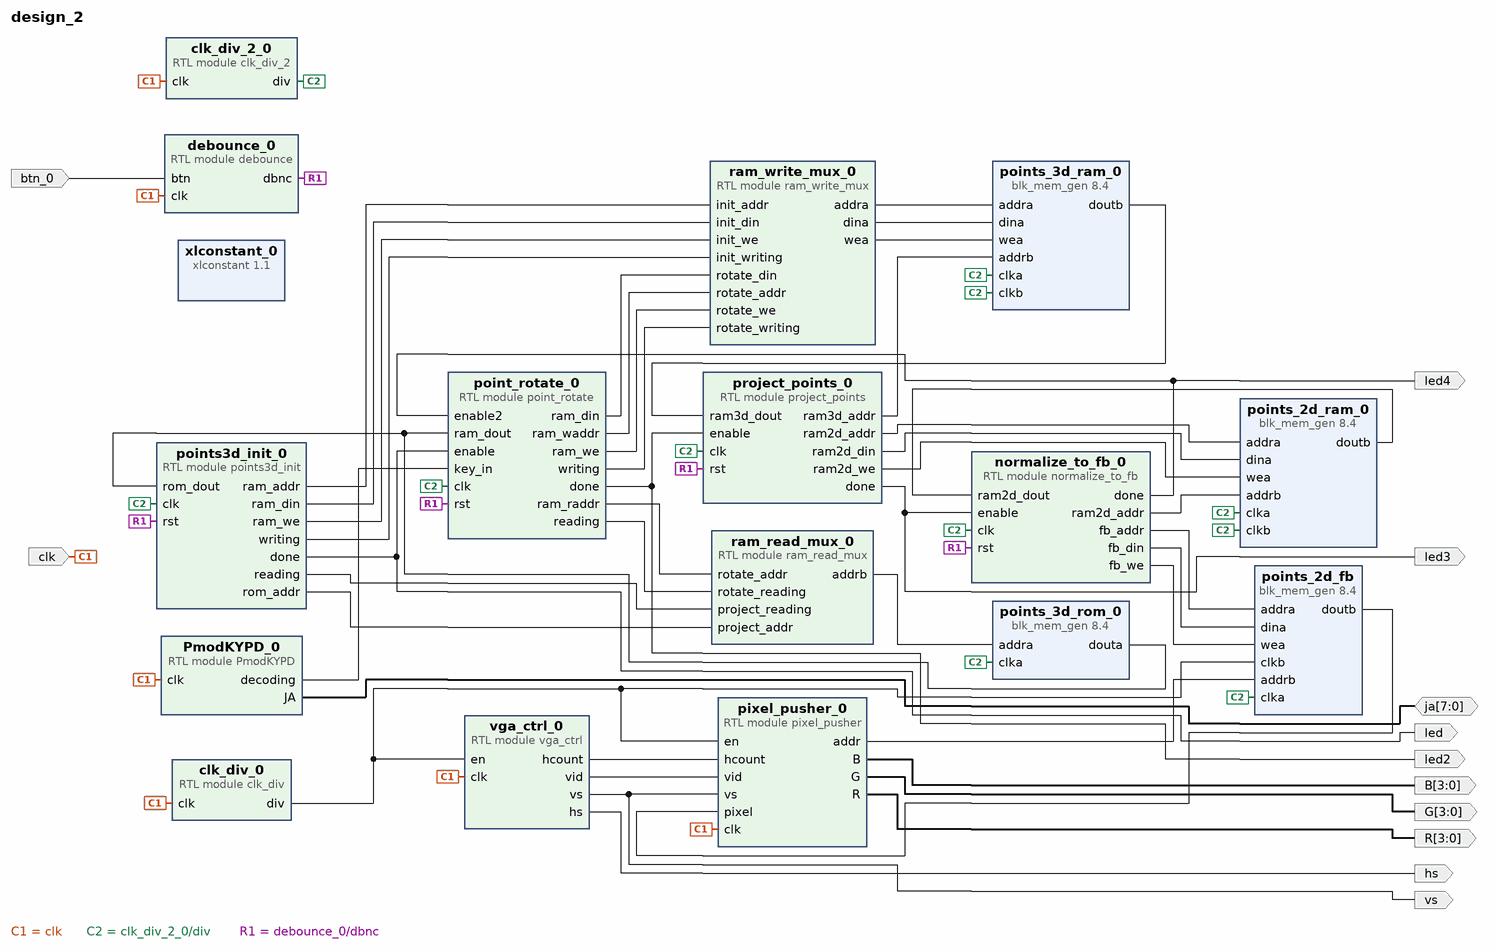
[diagram p0: block diagram of the top level]
# Vivado block design design_2, xc7z010clg400-1, Vivado 2021.1
create_bd_design design_2

create_bd_port -dir I -type clk clk
create_bd_port -dir O led
create_bd_port -dir I btn_0
create_bd_port -dir IO -from 7 -to 0 ja
create_bd_port -dir O led2
create_bd_port -dir O led3
create_bd_port -dir O -from 3 -to 0 R
create_bd_port -dir O -from 3 -to 0 B
create_bd_port -dir O -from 3 -to 0 G
create_bd_port -dir O vs
create_bd_port -dir O hs
create_bd_port -dir O led4

create_bd_cell -type ip -vlnv xilinx.com:ip:blk_mem_gen:8.4 points_3d_rom_0
set_property -dict [list \
  CONFIG.Coe_File {c:/Users/nihal/OneDrive/Desktop/Embed1 FP/reduced_output.coe} \
  CONFIG.Enable_32bit_Address false \
  CONFIG.Enable_A Always_Enabled \
  CONFIG.Load_Init_File true \
  CONFIG.Memory_Type Single_Port_ROM \
  CONFIG.Port_A_Write_Rate 0 \
  CONFIG.Port_B_Clock 0 \
  CONFIG.Port_B_Enable_Rate 0 \
  CONFIG.Port_B_Write_Rate 0 \
  CONFIG.Register_PortA_Output_of_Memory_Primitives false \
  CONFIG.Use_RSTA_Pin false \
  CONFIG.Write_Depth_A 11624 \
  CONFIG.Write_Width_A 48 \
  CONFIG.use_bram_block Stand_Alone \
] [get_bd_cells points_3d_rom_0]
create_bd_cell -type ip -vlnv xilinx.com:ip:blk_mem_gen:8.4 points_3d_ram_0
set_property -dict [list \
  CONFIG.Enable_32bit_Address false \
  CONFIG.Enable_A Always_Enabled \
  CONFIG.Enable_B Always_Enabled \
  CONFIG.Memory_Type True_Dual_Port_RAM \
  CONFIG.Operating_Mode_B WRITE_FIRST \
  CONFIG.Port_B_Clock 100 \
  CONFIG.Port_B_Enable_Rate 100 \
  CONFIG.Port_B_Write_Rate 50 \
  CONFIG.Read_Width_A 48 \
  CONFIG.Read_Width_B 48 \
  CONFIG.Register_PortA_Output_of_Memory_Primitives false \
  CONFIG.Register_PortB_Output_of_Memory_Primitives false \
  CONFIG.Use_Byte_Write_Enable false \
  CONFIG.Use_RSTA_Pin false \
  CONFIG.Write_Depth_A 11624 \
  CONFIG.Write_Width_A 48 \
  CONFIG.Write_Width_B 48 \
  CONFIG.use_bram_block Stand_Alone \
] [get_bd_cells points_3d_ram_0]
create_bd_cell -type module -reference debounce debounce_0
create_bd_cell -type module -reference PmodKYPD PmodKYPD_0
create_bd_cell -type ip -vlnv xilinx.com:ip:xlconstant:1.1 xlconstant_0
set_property -dict {CONFIG.CONST_VAL 10 CONFIG.CONST_WIDTH 4} [get_bd_cells xlconstant_0]
create_bd_cell -type ip -vlnv xilinx.com:ip:blk_mem_gen:8.4 points_2d_ram_0
set_property -dict [list \
  CONFIG.Enable_32bit_Address false \
  CONFIG.Enable_A Always_Enabled \
  CONFIG.Enable_B Always_Enabled \
  CONFIG.Memory_Type True_Dual_Port_RAM \
  CONFIG.Port_A_Write_Rate 50 \
  CONFIG.Port_B_Clock 100 \
  CONFIG.Port_B_Enable_Rate 100 \
  CONFIG.Port_B_Write_Rate 50 \
  CONFIG.Register_PortA_Output_of_Memory_Primitives false \
  CONFIG.Register_PortB_Output_of_Memory_Primitives false \
  CONFIG.Use_Byte_Write_Enable false \
  CONFIG.Use_RSTA_Pin false \
  CONFIG.Use_RSTB_Pin false \
  CONFIG.Write_Depth_A 11624 \
  CONFIG.use_bram_block Stand_Alone \
] [get_bd_cells points_2d_ram_0]
create_bd_cell -type ip -vlnv xilinx.com:ip:blk_mem_gen:8.4 points_2d_fb
set_property -dict [list \
  CONFIG.Enable_32bit_Address false \
  CONFIG.Enable_A Always_Enabled \
  CONFIG.Enable_B Always_Enabled \
  CONFIG.Memory_Type True_Dual_Port_RAM \
  CONFIG.Port_B_Clock 100 \
  CONFIG.Port_B_Enable_Rate 100 \
  CONFIG.Port_B_Write_Rate 50 \
  CONFIG.Read_Width_A 8 \
  CONFIG.Read_Width_B 8 \
  CONFIG.Register_PortA_Output_of_Memory_Primitives false \
  CONFIG.Register_PortB_Output_of_Memory_Primitives false \
  CONFIG.Use_Byte_Write_Enable false \
  CONFIG.Use_RSTA_Pin false \
  CONFIG.Write_Depth_A 57600 \
  CONFIG.Write_Width_A 8 \
  CONFIG.Write_Width_B 8 \
  CONFIG.use_bram_block Stand_Alone \
] [get_bd_cells points_2d_fb]
create_bd_cell -type module -reference ram_write_mux ram_write_mux_0
create_bd_cell -type module -reference ram_read_mux ram_read_mux_0
create_bd_cell -type module -reference clk_div clk_div_0
create_bd_cell -type module -reference vga_ctrl vga_ctrl_0
create_bd_cell -type module -reference clk_div_2 clk_div_2_0
create_bd_cell -type module -reference project_points project_points_0
create_bd_cell -type module -reference pixel_pusher pixel_pusher_0
create_bd_cell -type module -reference point_rotate point_rotate_0
create_bd_cell -type module -reference normalize_to_fb normalize_to_fb_0
create_bd_cell -type module -reference points3d_init points3d_init_0

# ---- connections ----

connect_bd_net [get_bd_ports ja] [get_bd_pins PmodKYPD_0/JA]
connect_bd_net [get_bd_pins PmodKYPD_0/decoding] [get_bd_pins point_rotate_0/key_in]
connect_bd_net -net btn_0_1 [get_bd_ports btn_0] [get_bd_pins debounce_0/btn]
connect_bd_net [get_bd_ports clk] \
  [get_bd_pins debounce_0/clk] [get_bd_pins clk_div_0/clk] [get_bd_pins PmodKYPD_0/clk] [get_bd_pins vga_ctrl_0/clk] \
  [get_bd_pins clk_div_2_0/clk] [get_bd_pins pixel_pusher_0/clk]
connect_bd_net [get_bd_pins clk_div_0/div] [get_bd_pins points_2d_fb/clkb] [get_bd_pins vga_ctrl_0/en] [get_bd_pins pixel_pusher_0/en]
connect_bd_net [get_bd_pins clk_div_2_0/div] \
  [get_bd_pins points_2d_fb/clka] [get_bd_pins points_2d_ram_0/clkb] [get_bd_pins points_2d_ram_0/clka] \
  [get_bd_pins points_3d_ram_0/clkb] [get_bd_pins points_3d_ram_0/clka] [get_bd_pins points_3d_rom_0/clka] \
  [get_bd_pins project_points_0/clk] [get_bd_pins point_rotate_0/clk] [get_bd_pins normalize_to_fb_0/clk] \
  [get_bd_pins points3d_init_0/clk]
connect_bd_net [get_bd_pins debounce_0/dbnc] \
  [get_bd_pins project_points_0/rst] [get_bd_pins point_rotate_0/rst] [get_bd_pins normalize_to_fb_0/rst] \
  [get_bd_pins points3d_init_0/rst]
connect_bd_net [get_bd_pins normalize_to_fb_0/done] [get_bd_ports led4] [get_bd_pins point_rotate_0/enable2]
connect_bd_net [get_bd_pins normalize_to_fb_0/fb_addr] [get_bd_pins points_2d_fb/addra]
connect_bd_net [get_bd_pins normalize_to_fb_0/fb_din] [get_bd_pins points_2d_fb/dina]
connect_bd_net [get_bd_pins normalize_to_fb_0/fb_we] [get_bd_pins points_2d_fb/wea]
connect_bd_net [get_bd_pins normalize_to_fb_0/ram2d_addr] [get_bd_pins points_2d_ram_0/addrb]
connect_bd_net [get_bd_pins pixel_pusher_0/B] [get_bd_ports B]
connect_bd_net [get_bd_pins pixel_pusher_0/G] [get_bd_ports G]
connect_bd_net [get_bd_pins pixel_pusher_0/R] [get_bd_ports R]
connect_bd_net [get_bd_pins pixel_pusher_0/addr] [get_bd_pins points_2d_fb/addrb]
connect_bd_net [get_bd_pins point_rotate_0/done] [get_bd_ports led2] [get_bd_pins project_points_0/enable]
connect_bd_net [get_bd_pins point_rotate_0/ram_din] [get_bd_pins ram_write_mux_0/rotate_din]
connect_bd_net [get_bd_pins point_rotate_0/ram_raddr] [get_bd_pins ram_read_mux_0/rotate_addr]
connect_bd_net [get_bd_pins point_rotate_0/ram_waddr] [get_bd_pins ram_write_mux_0/rotate_addr]
connect_bd_net [get_bd_pins point_rotate_0/ram_we] [get_bd_pins ram_write_mux_0/rotate_we]
connect_bd_net [get_bd_pins point_rotate_0/reading] [get_bd_pins ram_read_mux_0/rotate_reading]
connect_bd_net [get_bd_pins point_rotate_0/writing] [get_bd_pins ram_write_mux_0/rotate_writing]
connect_bd_net [get_bd_pins points3d_init_0/done] [get_bd_ports led] [get_bd_pins point_rotate_0/enable]
connect_bd_net [get_bd_pins points3d_init_0/ram_addr] [get_bd_pins ram_write_mux_0/init_addr]
connect_bd_net [get_bd_pins points3d_init_0/ram_din] [get_bd_pins ram_write_mux_0/init_din]
connect_bd_net [get_bd_pins points3d_init_0/ram_we] [get_bd_pins ram_write_mux_0/init_we]
connect_bd_net [get_bd_pins points3d_init_0/reading] [get_bd_pins ram_read_mux_0/project_reading]
connect_bd_net [get_bd_pins points3d_init_0/rom_addr] [get_bd_pins ram_read_mux_0/project_addr]
connect_bd_net [get_bd_pins points3d_init_0/writing] [get_bd_pins ram_write_mux_0/init_writing]
connect_bd_net [get_bd_pins points_2d_fb/doutb] [get_bd_pins pixel_pusher_0/pixel]
connect_bd_net [get_bd_pins points_2d_ram_0/doutb] [get_bd_pins normalize_to_fb_0/ram2d_dout]
connect_bd_net -net points_3d_0_douta [get_bd_pins points_3d_rom_0/douta] [get_bd_pins point_rotate_0/ram_dout] [get_bd_pins points3d_init_0/rom_dout]
connect_bd_net [get_bd_pins points_3d_ram_0/doutb] [get_bd_pins project_points_0/ram3d_dout]
connect_bd_net [get_bd_pins project_points_0/done] [get_bd_ports led3] [get_bd_pins normalize_to_fb_0/enable]
connect_bd_net [get_bd_pins project_points_0/ram2d_addr] [get_bd_pins points_2d_ram_0/addra]
connect_bd_net [get_bd_pins project_points_0/ram2d_din] [get_bd_pins points_2d_ram_0/dina]
connect_bd_net [get_bd_pins project_points_0/ram2d_we] [get_bd_pins points_2d_ram_0/wea]
connect_bd_net [get_bd_pins project_points_0/ram3d_addr] [get_bd_pins points_3d_ram_0/addrb]
connect_bd_net [get_bd_pins ram_read_mux_0/addrb] [get_bd_pins points_3d_rom_0/addra]
connect_bd_net [get_bd_pins ram_write_mux_0/addra] [get_bd_pins points_3d_ram_0/addra]
connect_bd_net [get_bd_pins ram_write_mux_0/dina] [get_bd_pins points_3d_ram_0/dina]
connect_bd_net [get_bd_pins ram_write_mux_0/wea] [get_bd_pins points_3d_ram_0/wea]
connect_bd_net [get_bd_pins vga_ctrl_0/hcount] [get_bd_pins pixel_pusher_0/hcount]
connect_bd_net [get_bd_pins vga_ctrl_0/hs] [get_bd_ports hs]
connect_bd_net [get_bd_pins vga_ctrl_0/vid] [get_bd_pins pixel_pusher_0/vid]
connect_bd_net [get_bd_pins vga_ctrl_0/vs] [get_bd_ports vs] [get_bd_pins pixel_pusher_0/vs]

validate_bd_design
save_bd_design
